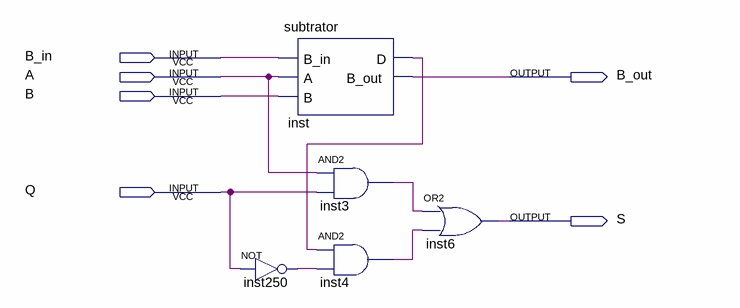
[diagram p0: schematic sheet]
// Quartus schematic divisor.bdf as structural Verilog: 5 symbols, 6 pins
module divisor (
  input  B_in,
  input  A,
  input  B,
  input  Q,
  output B_out,
  output S
);

  wire inst3_out, inst4_out, inst250_out, inst_d;

  not inst250 (inst250_out, Q);
  subtrator inst (.B_in(B_in), .A(A), .B(B), .D(inst_d), .B_out(B_out));
  and inst3 (inst3_out, A, Q);
  and inst4 (inst4_out, inst_d, inst250_out);
  or inst6 (S, inst3_out, inst4_out);
endmodule
